# Altium project Hub.PrjPcb
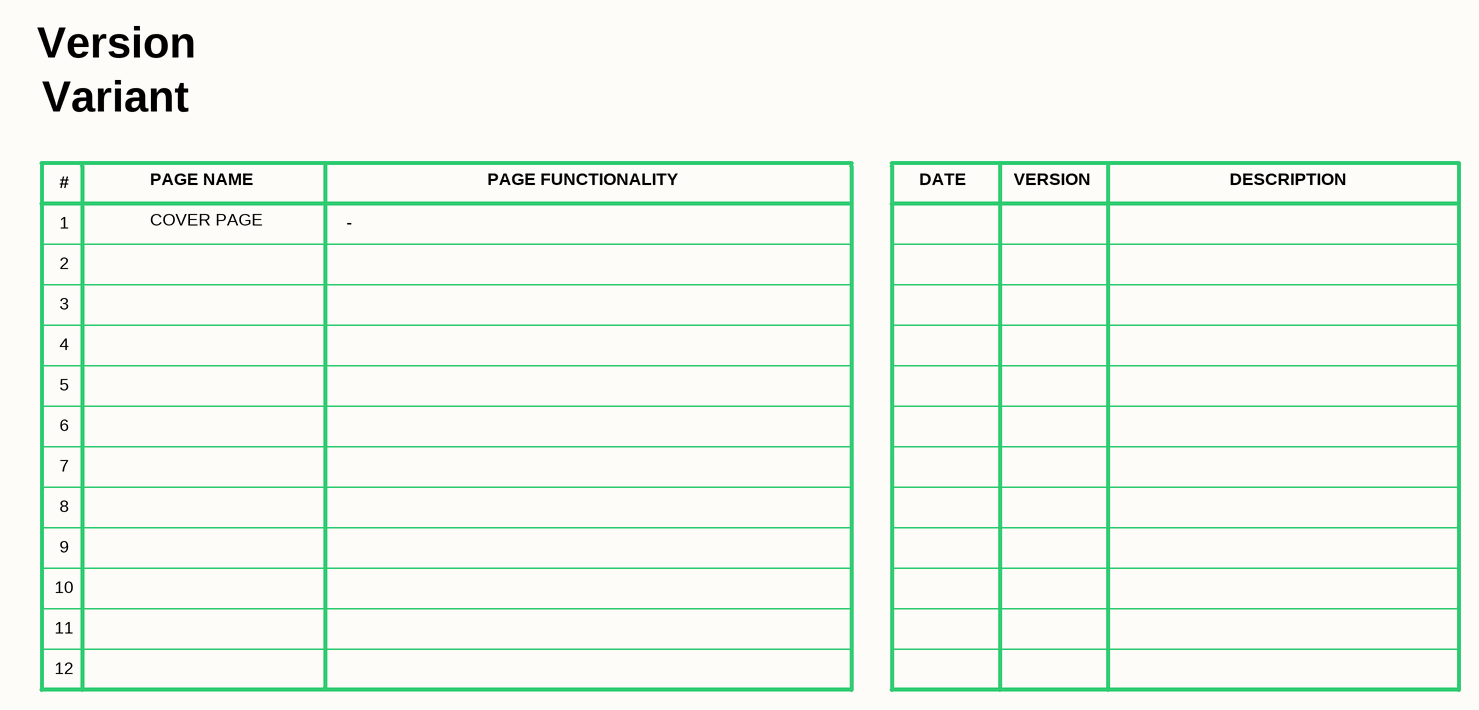
[diagram p0: 01 COVER PAGE.SchDoc]
Engineer_Email: contact@silardgal.com; Engineer_Link: silardgal.com; Engineer_Name: Silard Gal; Global_version: 1.0
6 sheets, 24 parts. Net scope: global (net labels, ports and power ports of the same name join across sheets).
Board file: PCB.PcbDoc
Sheets:
  01 COVER PAGE.SchDoc
  02 POWER.SchDoc
  03 USB7002-PartA.SchDoc
  04 USB7002-PartB.SchDoc
  05 LAN7800.SchDoc
  06 RS485.SchDoc

## Sheet 01 COVER PAGE.SchDoc: COVER PAGE
size 420 x 297 mm; SheetNumber: 1; SheetTotal: 6

### Notes on the sheet
- Version
- Variant
- #
- 1
- PAGE NAME
- COVER PAGE
- -
- PAGE FUNCTIONALITY
- DATE
- VERSION
- DESCRIPTION
- 2
- 3
- 4
- 5
- 6
- 7
- 8
- 9
- 10
- 11
- 12
- Title
- Project
- Size
- Date
- Revision
- A3
- Designed By

## Sheet 02 POWER.SchDoc: POWER
size 420 x 297 mm; SheetNumber: 2; SheetTotal: 6
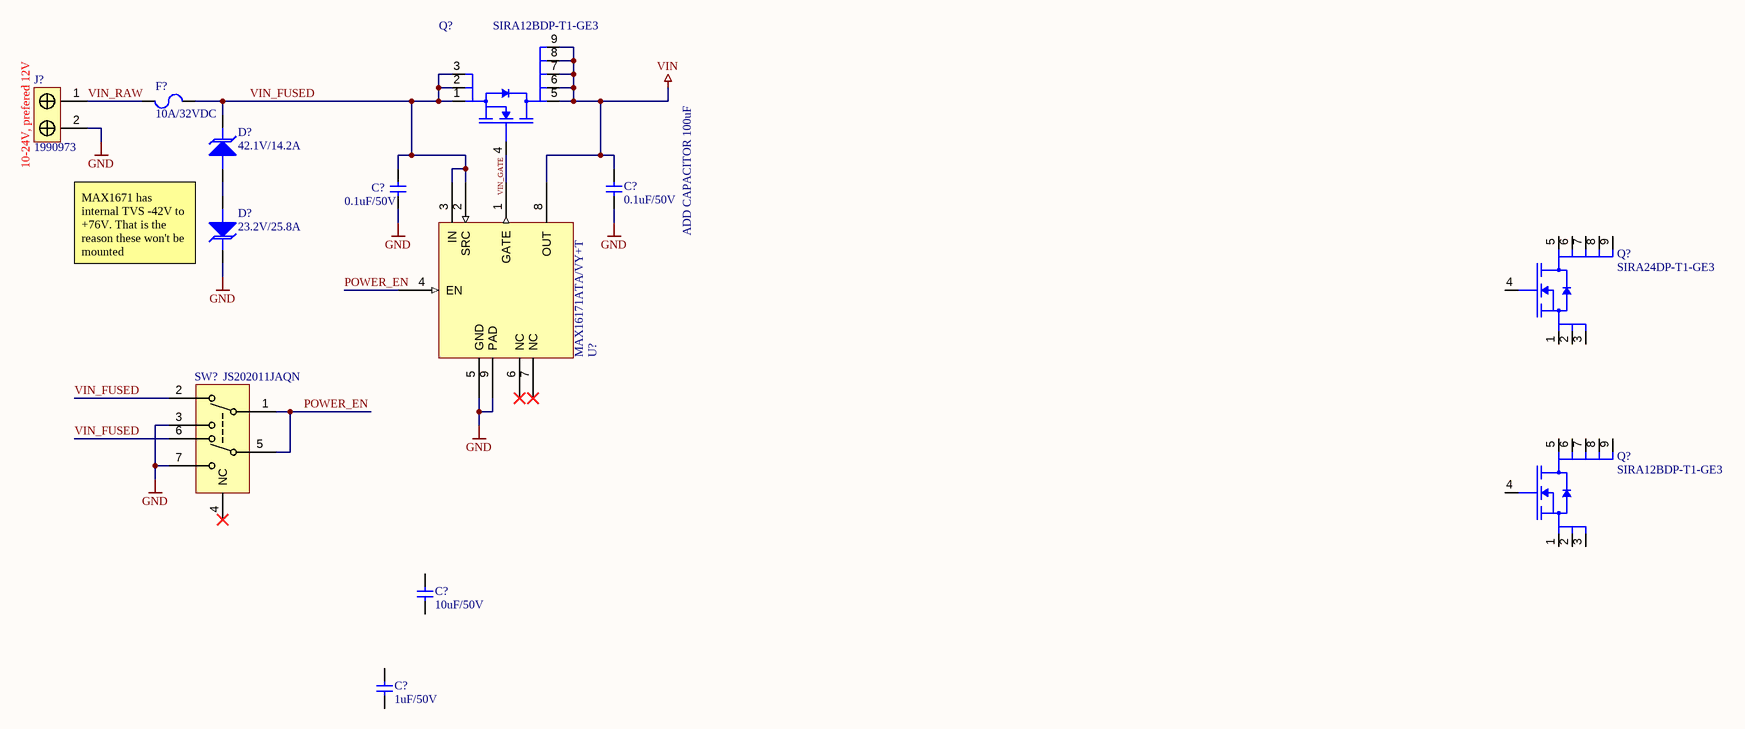
[diagram p1: 02 POWER.SchDoc]

### Parts
(Parts that share a designator on the sheet are numbered #1, #2 ... from top to bottom, then left to right.)
C?#1  0.1uF/50V  [CAPC1005X06N]
C?#2  0.1uF/50V  [CAPC1005X06N]
C?#3  10uF/50V  [CAPC3216X18N]
C?#4  1uF/50V  [INDC1608X10N]
D?#1  42.1V/14.2A  [DIOM4739X26N]
D?#2  23.2V/25.8A  [DIOM4739X26N]
F?  10A/32VDC  [FUSE3216X08N]
J?#1  1990973  [1990973]
Q?#1  SIRA12BDP-T1-GE3  [POWERPAK-SO-8-Single]
Q?#2  SIRA24DP-T1-GE3  [POWERPAK-SO-8-Single]
Q?#3  SIRA12BDP-T1-GE3  [POWERPAK-SO-8-Single]
SW?  JS202011JAQN  [JS202011JAQN]
U?#1  MAX16171ATA/VY+T  [PSON50P300X80_HS-9N]

### Nets
GND: C?#1.2 C?#2.1 D?#2.1 J?#1.2 SW?.3 SW?.7 U?#1.5(GND) U?#1.9(PAD)
VIN: C?#2.2 Q?#1.5 Q?#1.6 Q?#1.7 Q?#1.8 Q?#1.9 U?#1.8(OUT)
POWER_EN: SW?.1 U?#1.4(EN)
VIN_FUSED: C?#1.1 D?#1.1 F?.2 Q?#1.1 Q?#1.2 Q?#1.3 SW?.2 SW?.6 U?#1.2(SRC) U?#1.3(IN)
VIN_RAW: F?.1 J?#1.1
NetD?#1_2: D?#1.2 D?#2.2
NetQ?#1_4: Q?#1.4 U?#1.1(GATE)

Not connected (* = marked no-connect by the designer): C?#3 1 2; C?#4 1 2; Q?#2 1 2 3 4 5 6 7 8 9; Q?#3 1 2 3 4 5 6 7 8 9; SW? 4(NC)* 5; U?#1 6(NC)* 7(NC)*

### Notes on the sheet
- (near J?#1) 10-24V, prefered 12V
- ADD CAPACITOR 100uF
- (near D?#2) MAX1671 has internal TVS -42V to +76V. That is the reason these won't be mounted
- Labels drawn without touching a wire or pin: VIN_GATE
- Title
- Project
- Size
- Date
- Revision
- A3
- Designed By

### Library data of the parts
C?#1 C?#2 = GCM1555C1H101JA16D: 100 pF ±5% 50V Ceramic Capacitor C0G, NP0 0402 (1005 Metric); manufacturer: Murata Electronics; mfr_part_number: GCM1555C1H101JA16D; assembler_number: GCM1555C1H101JA16D; datasheet: https://www.murata.com/-/media/webrenewal/support/library/catalog/products/k35e.ashx?la=en-us&cvid=20200508021757000000
C?#3 = GRT31CR61H106ME01L: 10 µF ±20% 50V Ceramic Capacitor X5R 1206 (3216 Metric); manufacturer: Murata Electronics; mfr_part_number: GRT31CR61H106ME01L; assembler_number: GRT31CR61H106ME01L; datasheet: https://search.murata.co.jp/Ceramy/image/img/A01X/G101/ENG/GRT31CR61H106ME01-01.pdf
C?#4 = GRT188R61H105KE13D: 1 µF ±10% 50V Ceramic Capacitor X5R 0603 (1608 Metric); manufacturer: Murata Electronics; mfr_part_number: GRT188R61H105KE13D; assembler_number: GRT188R61H105KE13D; datasheet: https://search.murata.co.jp/Ceramy/image/img/A01X/G101/ENG/GRT188R61H105KE13-01.pdf
D?#1 = SMBJ26A-13-F: 42.1V Clamp 14.2A Ipp Tvs Diode Surface Mount SMB; manufacturer: Diodes Incorporated; mfr_part_number: SMBJ26A-13-F; assembler_number: SMBJ26A-13-F; datasheet: https://www.diodes.com/assets/Datasheets/ds19002.pdf
D?#2 = SMBJ14A-13-F: 23.2V Clamp 25.8A Ipp Tvs Diode Surface Mount SMB; manufacturer: Diodes Incorporated; mfr_part_number: SMBJ14A-13-F; assembler_number: SMBJ14A-13-F; datasheet: https://www.diodes.com/assets/Datasheets/ds19002.pdf
F? = 0685H9100-01: 10 A 125 V AC 32 V DC Fuse Board Mount (Cartridge Style Excluded) Surface Mount 1206 (3216 Metric); manufacturer: Bel Fuse Inc.; mfr_part_number: 0685H9100-01; assembler_number: 0685H9100-01; datasheet: https://www.belfuse.com/resources/datasheets/circuitprotection/ds-cp-c1h-series.pdf
J?#1 = 1990973: 2 Position Wire to Board Terminal Block Horizontal with Board 0.197" (5.00mm) Through Hole; manufacturer: Phoenix Contact; mfr_part_number: 1990973; assembler_number: 1990973; datasheet: https://www.phoenixcontact.com/en-pc/products/pcb-terminal-block-spt-25-2-h-50-1990973
Q?#1 Q?#3 = SIRA12BDP-T1-GE3: N-Channel 30 V 27A (Ta), 60A (Tc) 5W (Ta), 38W (Tc) Surface Mount PowerPAK® SO-8; manufacturer: Vishay Siliconix; mfr_part_number: SIRA12BDP-T1-GE3; assembler_number: SIRA12BDP-T1-GE3; datasheet: https://www.vishay.com/docs/76390/sira12bdp.pdf
Q?#2 = SIRA24DP-T1-GE3: N-Channel 25 V 60A (Tc) 62.5W (Tc) Surface Mount PowerPAK® SO-8; manufacturer: Vishay Siliconix; mfr_part_number: SIRA24DP-T1-GE3; assembler_number: SIRA24DP-T1-GE3; datasheet: https://www.vishay.com/docs/75453/sira24dp.pdf
SW? = JS202011JAQN: Slide Switch DPDT Surface Mount, Right Angle; manufacturer: C&K; mfr_part_number: JS202011JAQN; assembler_number: JS202011JAQN; datasheet: https://www.ckswitches.com/media/1422/js.pdf
U?#1 = MAX16171ATA/VY+T: OR Controller N+1 ORing Controller N-Channel 1:1 8-TDFN-CU (2x3); manufacturer: Analog Devices Inc./Maxim Integrated; mfr_part_number: MAX16171ATA/VY+T; assembler_number: MAX16171ATA/VY+T; datasheet: https://datasheets.maximintegrated.com/en/ds/MAX16171.pdf

## Sheet 03 USB7002-PartA.SchDoc: USB7002 - Part A
size 420 x 297 mm; SheetNumber: 3; SheetTotal: 5
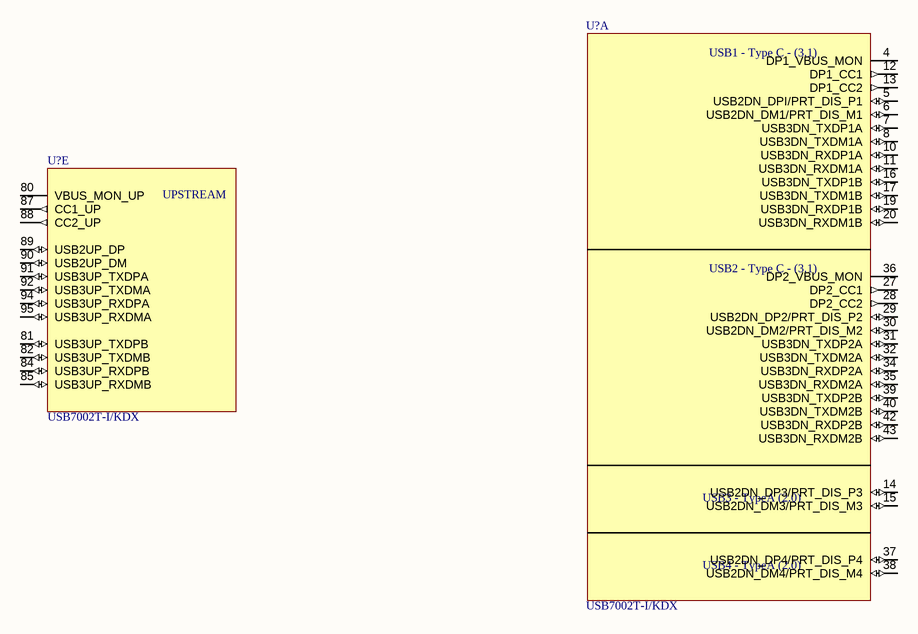
[diagram p2: 03 USB7002-PartA.SchDoc]

### Parts
(Parts that share a designator on the sheet are numbered #1, #2 ... from top to bottom, then left to right.)
U?#2  USB7002T-I/KDX  [QFN40P1200X1200X90_HS-101N]  (part E of 5)
U?#3  USB7002T-I/KDX  [QFN40P1200X1200X90_HS-101N]  (part A of 5)

### Nets

Not connected (* = marked no-connect by the designer): U?#2 80(VBUS_MON_UP) 81(USB3UP_TXDPB) 82(USB3UP_TXDMB) 84(USB3UP_RXDPB) 85(USB3UP_RXDMB) 87(CC1_UP) 88(CC2_UP) 89(USB2UP_DP) 90(USB2UP_DM) 91(USB3UP_TXDPA) 92(USB3UP_TXDMA) 94(USB3UP_RXDPA) 95(USB3UP_RXDMA); U?#3 4(DP1_VBUS_MON) 5(USB2DN_DPI/PRT_DIS_P1) 6(USB2DN_DM1/PRT_DIS_M1) 7(USB3DN_TXDP1A) 8(USB3DN_TXDM1A) 10(USB3DN_RXDP1A) 11(USB3DN_RXDM1A) 12(DP1_CC1) 13(DP1_CC2) 14(USB2DN_DP3/PRT_DIS_P3) 15(USB2DN_DM3/PRT_DIS_M3) 16(USB3DN_TXDP1B) 17(USB3DN_TXDM1B) 19(USB3DN_RXDP1B) 20(USB3DN_RXDM1B) 27(DP2_CC1) 28(DP2_CC2) 29(USB2DN_DP2/PRT_DIS_P2) 30(USB2DN_DM2/PRT_DIS_M2) 31(USB3DN_TXDP2A) 32(USB3DN_TXDM2A) 34(USB3DN_RXDP2A) 35(USB3DN_RXDM2A) 36(DP2_VBUS_MON) 37(USB2DN_DP4/PRT_DIS_P4) 38(USB2DN_DM4/PRT_DIS_M4) 39(USB3DN_TXDP2B) 40(USB3DN_TXDM2B) 42(USB3DN_RXDP2B) 43(USB3DN_RXDM2B)

### Notes on the sheet
- Title
- Project
- Size
- Date
- Revision
- A3
- Designed By
- (in symbol USB7002T-I/KDX, part A) USB1 - Type C - (3.1); USB2 - Type C - (3.1); USB3 - TypeA (2.0); USB4 - TypeA (2.0)
- (in symbol USB7002T-I/KDX, part E) UPSTREAM

### Library data of the parts
U?#2 U?#3 = USB7002T-I/KDX: USB Hub Controller USB 3.1 USB Interface 100-VQFN (12x12); manufacturer: Microchip Technology; mfr_part_number: USB7002T-I/KDX; assembler_number: USB7002T-I/KDX; datasheet: https://ww1.microchip.com/downloads/en/DeviceDoc/USB7002-Data-Sheet-DS00002670F.pdf

## Sheet 04 USB7002-PartB.SchDoc: USB7002 - Part B
size 420 x 297 mm; SheetNumber: 4; SheetTotal: 6
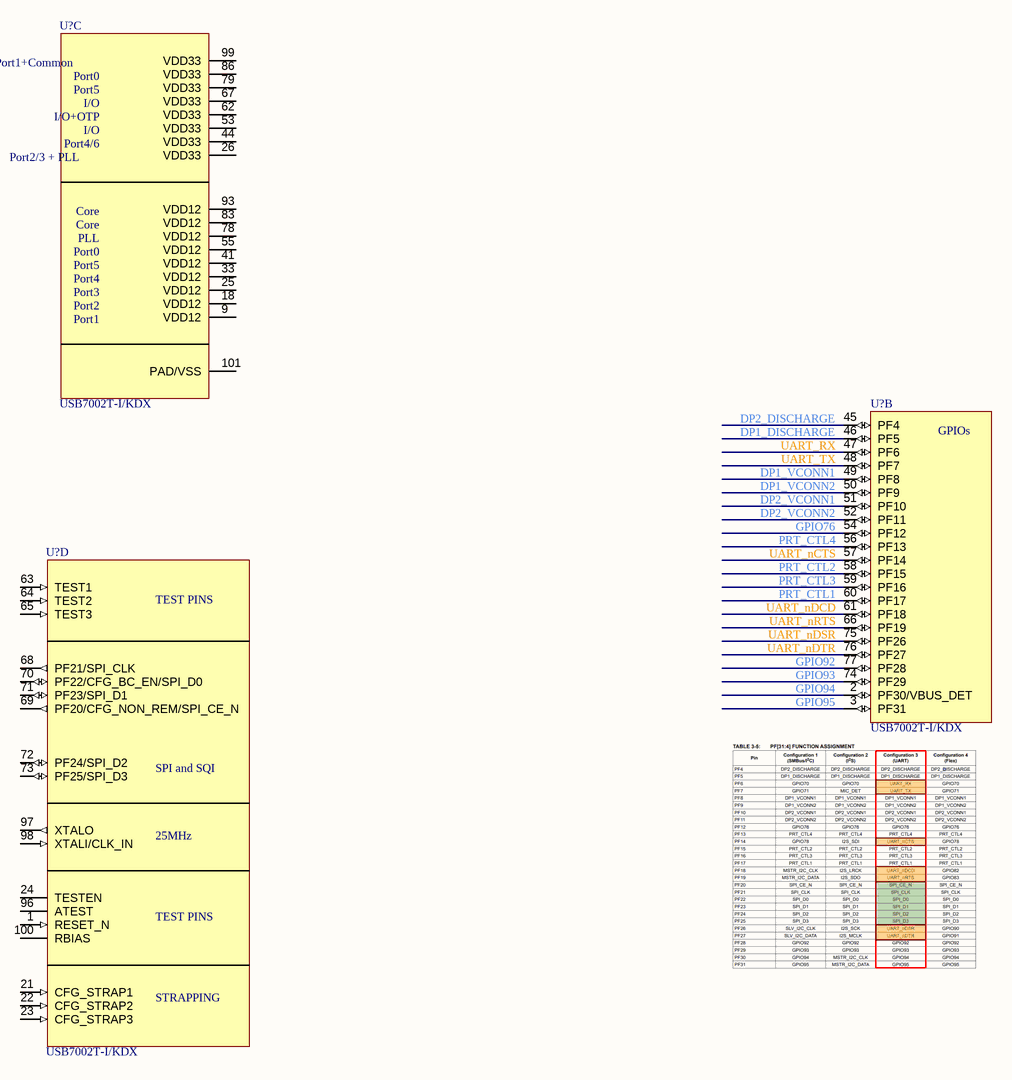
[diagram p3: 04 USB7002-PartB.SchDoc]

### Parts
(Parts that share a designator on the sheet are numbered #1, #2 ... from top to bottom, then left to right.)
U?#4  USB7002T-I/KDX  [QFN40P1200X1200X90_HS-101N]  (part C of 5)
U?#5  USB7002T-I/KDX  [QFN40P1200X1200X90_HS-101N]  (part B of 5)
U?#6  USB7002T-I/KDX  [QFN40P1200X1200X90_HS-101N]  (part D of 5)

### Nets

Not connected (* = marked no-connect by the designer): U?#4 9(VDD12) 18(VDD12) 25(VDD12) 26(VDD33) 33(VDD12) 41(VDD12) 44(VDD33) 53(VDD33) 55(VDD12) 62(VDD33) 67(VDD33) 78(VDD12) 79(VDD33) 83(VDD12) 86(VDD33) 93(VDD12) 99(VDD33) 101(PAD/VSS); U?#5 2(PF30/VBUS_DET) 3(PF31) 45(PF4) 46(PF5) 47(PF6) 48(PF7) 49(PF8) 50(PF9) 51(PF10) 52(PF11) 54(PF12) 56(PF13) 57(PF14) 58(PF15) 59(PF16) 60(PF17) 61(PF18) 66(PF19) 74(PF29) 75(PF26) 76(PF27) 77(PF28); U?#6 1(RESET_N) 21(CFG_STRAP1) 22(CFG_STRAP2) 23(CFG_STRAP3) 24(TESTEN) 63(TEST1) 64(TEST2) 65(TEST3) 68(PF21/SPI_CLK) 69(PF20/CFG_NON_REM/SPI_CE_N) 70(PF22/CFG_BC_EN/SPI_D0) 71(PF23/SPI_D1) 72(PF24/SPI_D2) 73(PF25/SPI_D3) 96(ATEST) 97(XTALO) 98(XTALI/CLK_IN) 100(RBIAS)

### Notes on the sheet
- (near U?#5) DP2_DISCHARGE
- (near U?#5) DP1_DISCHARGE
- (near U?#5) UART_RX
- (near U?#5) UART_TX
- (near U?#5) DP1_VCONN1
- (near U?#5) DP1_VCONN2
- (near U?#5) DP2_VCONN1
- (near U?#5) DP2_VCONN2
- (near U?#5) GPIO76
- (near U?#5) PRT_CTL4
- (near U?#5) UART_nCTS
- (near U?#5) PRT_CTL2
- (near U?#5) PRT_CTL3
- (near U?#5) PRT_CTL1
- (near U?#5) UART_nDCD
- (near U?#5) UART_nRTS
- (near U?#5) UART_nDSR
- (near U?#5) UART_nDTR
- (near U?#5) GPIO92
- (near U?#5) GPIO93
- (near U?#5) GPIO94
- (near U?#5) GPIO95
- Title
- Project
- Size
- Date
- Revision
- A3
- Designed By
- (in symbol USB7002T-I/KDX, part B) GPIOs
- (in symbol USB7002T-I/KDX, part C) Port1+Common; Port0; Port5; I/O; I/O+OTP; Port4/6; Port2/3 + PLL; Core; PLL; Port4; Port3; Port2; Port1
- (in symbol USB7002T-I/KDX, part D) TEST PINS; SPI and SQI; 25MHz; STRAPPING

### Library data of the parts
U?#4-U?#6 = USB7002T-I/KDX: as U?#2 on sheet 03 USB7002-PartA; mfr_part_number: USB7002T-I/KDX; assembler_number: USB7002T-I/KDX; datasheet: https://ww1.microchip.com/downloads/en/DeviceDoc/USB7002-Data-Sheet-DS00002670F.pdf

## Sheet 05 LAN7800.SchDoc: LAN7800
size 420 x 297 mm; SheetNumber: 5; SheetTotal: 6
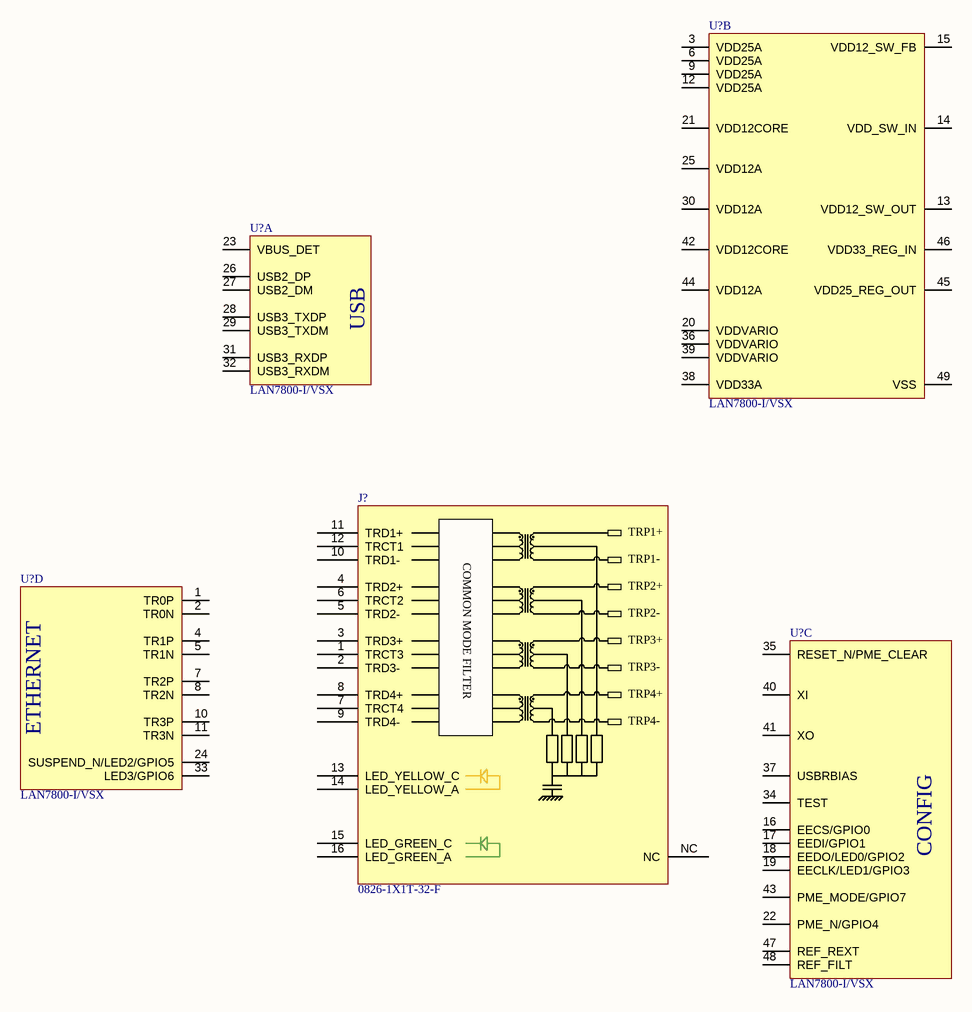
[diagram p4: 05 LAN7800.SchDoc]

### Parts
(Parts that share a designator on the sheet are numbered #1, #2 ... from top to bottom, then left to right.)
J?#2  0826-1X1T-32-F  [0826-1X1T-32-F]
U?#7  LAN7800-I/VSX  (part A of 4)
U?#8  LAN7800-I/VSX  (part B of 4)
U?#9  LAN7800-I/VSX  (part D of 4)
U?#10  LAN7800-I/VSX  (part C of 4)

### Nets

Not connected (* = marked no-connect by the designer): J?#2 1(TRCT3) 2(TRD3-) 3(TRD3+) 4(TRD2+) 5(TRD2-) 6(TRCT2) 7(TRCT4) 8(TRD4+) 9(TRD4-) 10(TRD1-) 11(TRD1+) 12(TRCT1) 13(LED_YELLOW_C) 14(LED_YELLOW_A) 15(LED_GREEN_C) 16(LED_GREEN_A) NC; U?#7 23(VBUS_DET) 26(USB2_DP) 27(USB2_DM) 28(USB3_TXDP) 29(USB3_TXDM) 31(USB3_RXDP) 32(USB3_RXDM); U?#8 3(VDD25A) 6(VDD25A) 9(VDD25A) 12(VDD25A) 13(VDD12_SW_OUT) 14(VDD_SW_IN) 15(VDD12_SW_FB) 20(VDDVARIO) 21(VDD12CORE) 25(VDD12A) 30(VDD12A) 36(VDDVARIO) 38(VDD33A) 39(VDDVARIO) 42(VDD12CORE) 44(VDD12A) 45(VDD25_REG_OUT) 46(VDD33_REG_IN) 49(VSS); U?#9 1(TR0P) 2(TR0N) 4(TR1P) 5(TR1N) 7(TR2P) 8(TR2N) 10(TR3P) 11(TR3N) 24(SUSPEND_N/LED2/GPIO5) 33(LED3/GPIO6); U?#10 16(EECS/GPIO0) 17(EEDI/GPIO1) 18(EEDO/LED0/GPIO2) 19(EECLK/LED1/GPIO3) 22(PME_N/GPIO4) 34(TEST) 35(RESET_N/PME_CLEAR) 37(USBRBIAS) 40(XI) 41(XO) 43(PME_MODE/GPIO7) 47(REF_REXT) 48(REF_FILT)

### Notes on the sheet
- Title
- Project
- Size
- Date
- Revision
- A3
- Designed By
- (in symbol 0826-1X1T-32-F) TRP1+; COMMON MODE FILTER; TRP1-; TRP2+; TRP2-; TRP3+; TRP3-; TRP4+; TRP4-
- (in symbol LAN7800-I/VSX, part A) USB
- (in symbol LAN7800-I/VSX, part C) CONFIG
- (in symbol LAN7800-I/VSX, part D) ETHERNET

### Library data of the parts
J?#2 = 0826-1X1T-32-F: 1 Port RJ45Through Hole 10/100/1000 Base-T, AutoMDIX; manufacturer: Bel Fuse Inc.; mfr_part_number: 0826-1X1T-32-F; assembler_number: 0826-1X1T-32-F; datasheet: https://www.belfuse.com/resources/drawings/magneticsolutions/dr-mag-0826-1x1t-32-f.pdf
U?#7-U?#10 = LAN7800-I/VSX: Ethernet Controller 10/100/1000 Base-TX PHY Interface 48-SQFN (6x6); manufacturer: Microchip Technology; mfr_part_number: LAN7800-I/VSX; assembler_number: LAN7800-I/VSX; datasheet: https://ww1.microchip.com/downloads/en/DeviceDoc/LAN7800-Data-Sheet-DS00001992G.pdf

## Sheet 06 RS485.SchDoc: RS485
size 420 x 297 mm; SheetNumber: 6; SheetTotal: 6
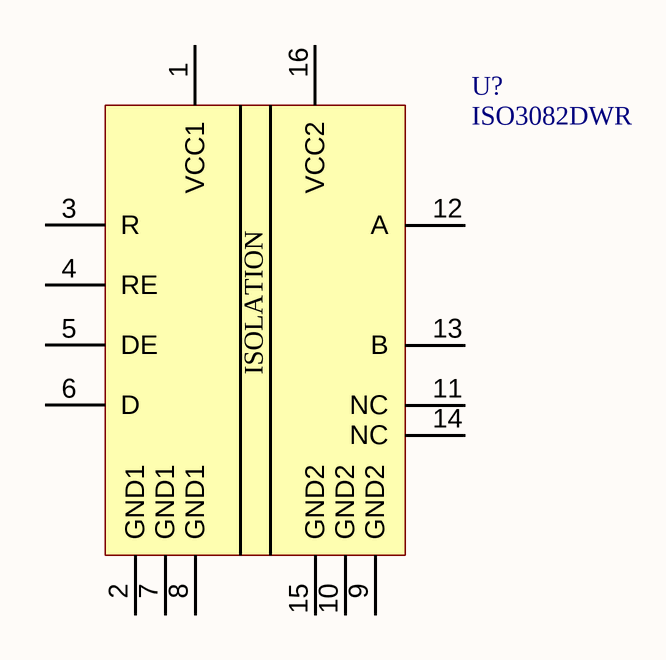
[diagram p5: 06 RS485.SchDoc]

### Parts
(Parts that share a designator on the sheet are numbered #1, #2 ... from top to bottom, then left to right.)
U?#11  ISO3082DWR  [SOIC127P1030X265-16N]

### Nets

Not connected (* = marked no-connect by the designer): U?#11 1(VCC1) 2(GND1) 3(R) 4(RE) 5(DE) 6(D) 7(GND1) 8(GND1) 9(GND2) 10(GND2) 11(NC) 12(A) 13(B) 14(NC) 15(GND2) 16(VCC2)

### Notes on the sheet
- Title
- Project
- Size
- Date
- Revision
- A3
- Designed By
- (in symbol ISO3082DWR) ISOLATION

### Library data of the parts
U?#11 = ISO3082DWR: 2/2 Transceiver, Isolated Half RS422, RS485 16-SOIC; manufacturer: Texas Instruments; mfr_part_number: ISO3082DWR; assembler_number: ISO3082DWR; datasheet: https://www.ti.com/general/docs/suppproductinfo.tsp?distId=10&gotoUrl=https%3A%2F%2Fwww.ti.com%2Flit%2Fgpn%2Fiso3082